# EAGLE design PR9003 (EAGLE 6.6.0)
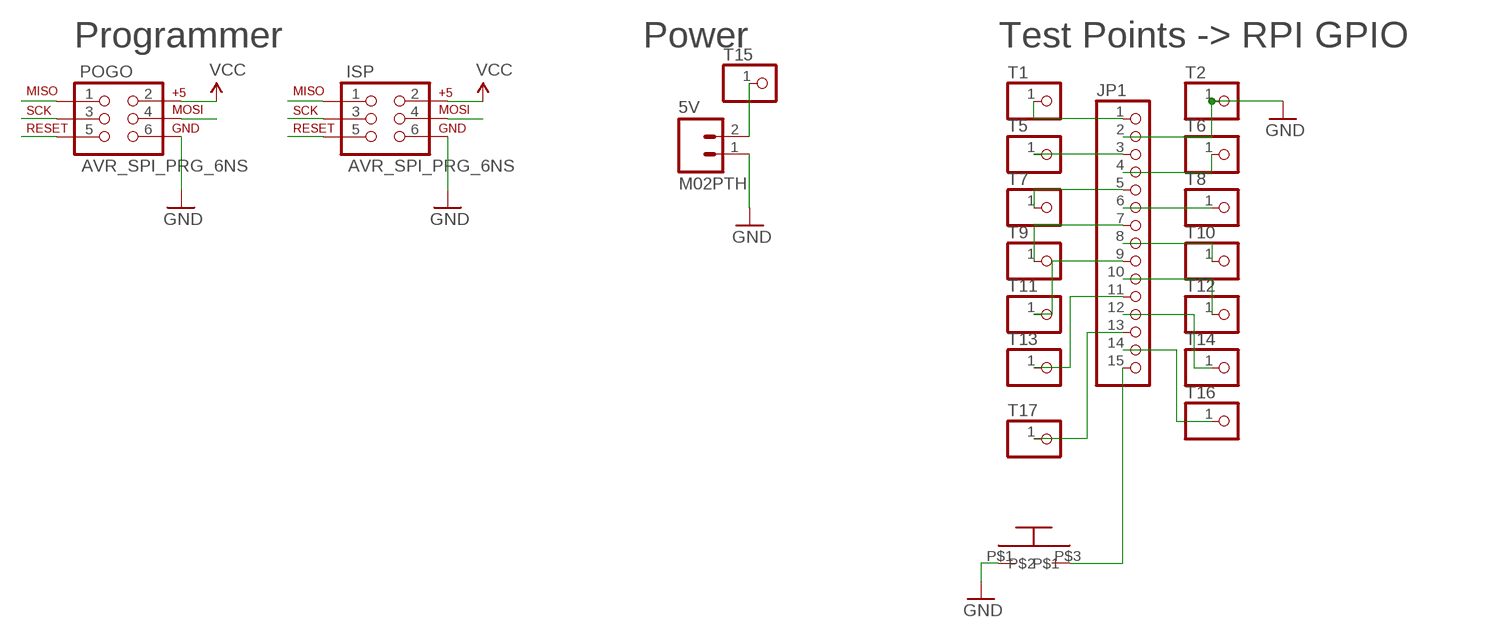
[diagram p0: schematic, sheet 1]

## Parts
5V  M02PTH  [1X02]
ISP  AVR_SPI_PRG_6NS  [2X3-NS]
JP1  PINHD-1X15  [1X15]
POGO  AVR_SPI_PRG_6NS  [2X3-NS]
T1  PINHD-1X1  [1X01]
T2  PINHD-1X1  [1X01]
T5  PINHD-1X1  [1X01]
T6  PINHD-1X1  [1X01]
T7  PINHD-1X1  [1X01]
T8  PINHD-1X1  [1X01]
T9  PINHD-1X1  [1X01]
T10  PINHD-1X1  [1X01]
T11  PINHD-1X1  [1X01]
T12  PINHD-1X1  [1X01]
T13  PINHD-1X1  [1X01]
T14  PINHD-1X1  [1X01]
T15  PINHD-1X1  [1X01]
T16  PINHD-1X1  [1X01]
T17  PINHD-1X1  [1X01]
U$1  C&K_D6C_SWITCH  [C&K_D6C_SWITCH]

## Nets
GND: 5V.1 ISP.6 JP1.2 POGO.6 T2.1 U$1.P$1
MISO: ISP.1 POGO.1
MOSI: ISP.4 POGO.4
N$1: JP1.1 T1.1
N$3: JP1.3 T5.1
N$4: JP1.4 T6.1
N$5: JP1.5 T7.1
N$6: JP1.6 T8.1
N$7: JP1.7 T9.1
N$8: JP1.8 T10.1
N$9: JP1.9 T11.1
N$10: JP1.10 T12.1
N$11: JP1.11 T13.1
N$12: JP1.12 T14.1
N$13: 5V.2 T15.1
N$14: JP1.14 T16.1
N$15: JP1.13 T17.1
N$16: JP1.15 U$1.P$3
RESET: ISP.5 POGO.5
SCK: ISP.3 POGO.3
VCC: ISP.2 POGO.2

## Notes on the sheet
- Programmer | Power | Test Points -> RPI GPIO

## Library data of the parts
5V = SparkFun-Connectors:M02: Standard 2-pin 0.1" header. Use with - straight break away headers ( PRT-00116) - right angle break away headers (PRT-00553) - swiss pins (PRT-00743) - machine pins (PRT-00117) - female headers (PRT-00115) Molex polarized connector foot print use with: PRT-08233 with associated crimp pins and housings. 2.54_SCREWTERM for use with PRT-10571. 3.5mm Screw Terminal footprints for PRT-08084 5mm Screw Terminal footprints for use with PRT-08432
ISP POGO = SparkFun-Connectors:AVR_SPI_PRG_6: AVR ISP 6 Pin This is the reduced ISP connector for AVR programming. Common on Arduino. This footprint will take up less PCB space and can be used with a 10-pin to 6-pin adapter such as SKU: BOB-08508 **Special note about "TEST_POINT" package. The stop mask is on the top side, so if you want your programming test points to be on the bottom of your board, make sure to place this package on the bottom side of the board. This also ensure that the orientation to program from the bottom side will be correct.
JP1 = adafruit:PINHD-1X15: PIN HEADER
T1 T2 T5-T17 = adafruit:PINHD-1X1: Pin header 1x1 for 0.1" spacing With round pins
U$1 = PR_Parts_Library:C&K_D6C_SWITCH

## Board
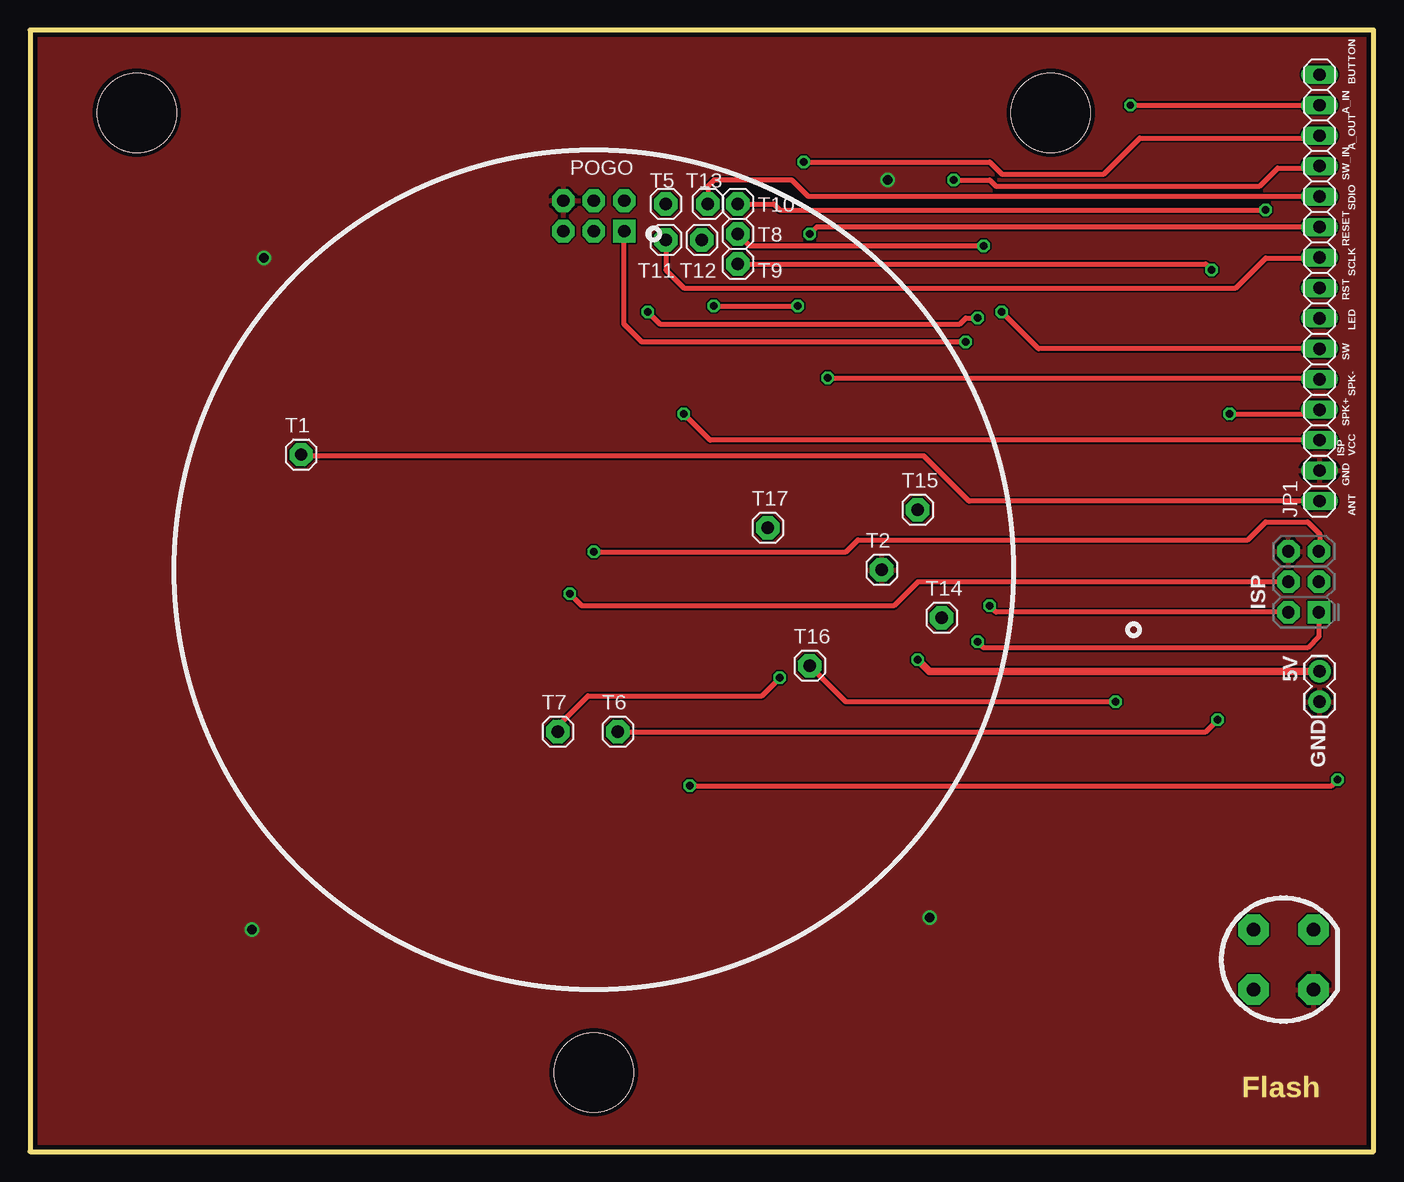
[diagram p1: board, top side]
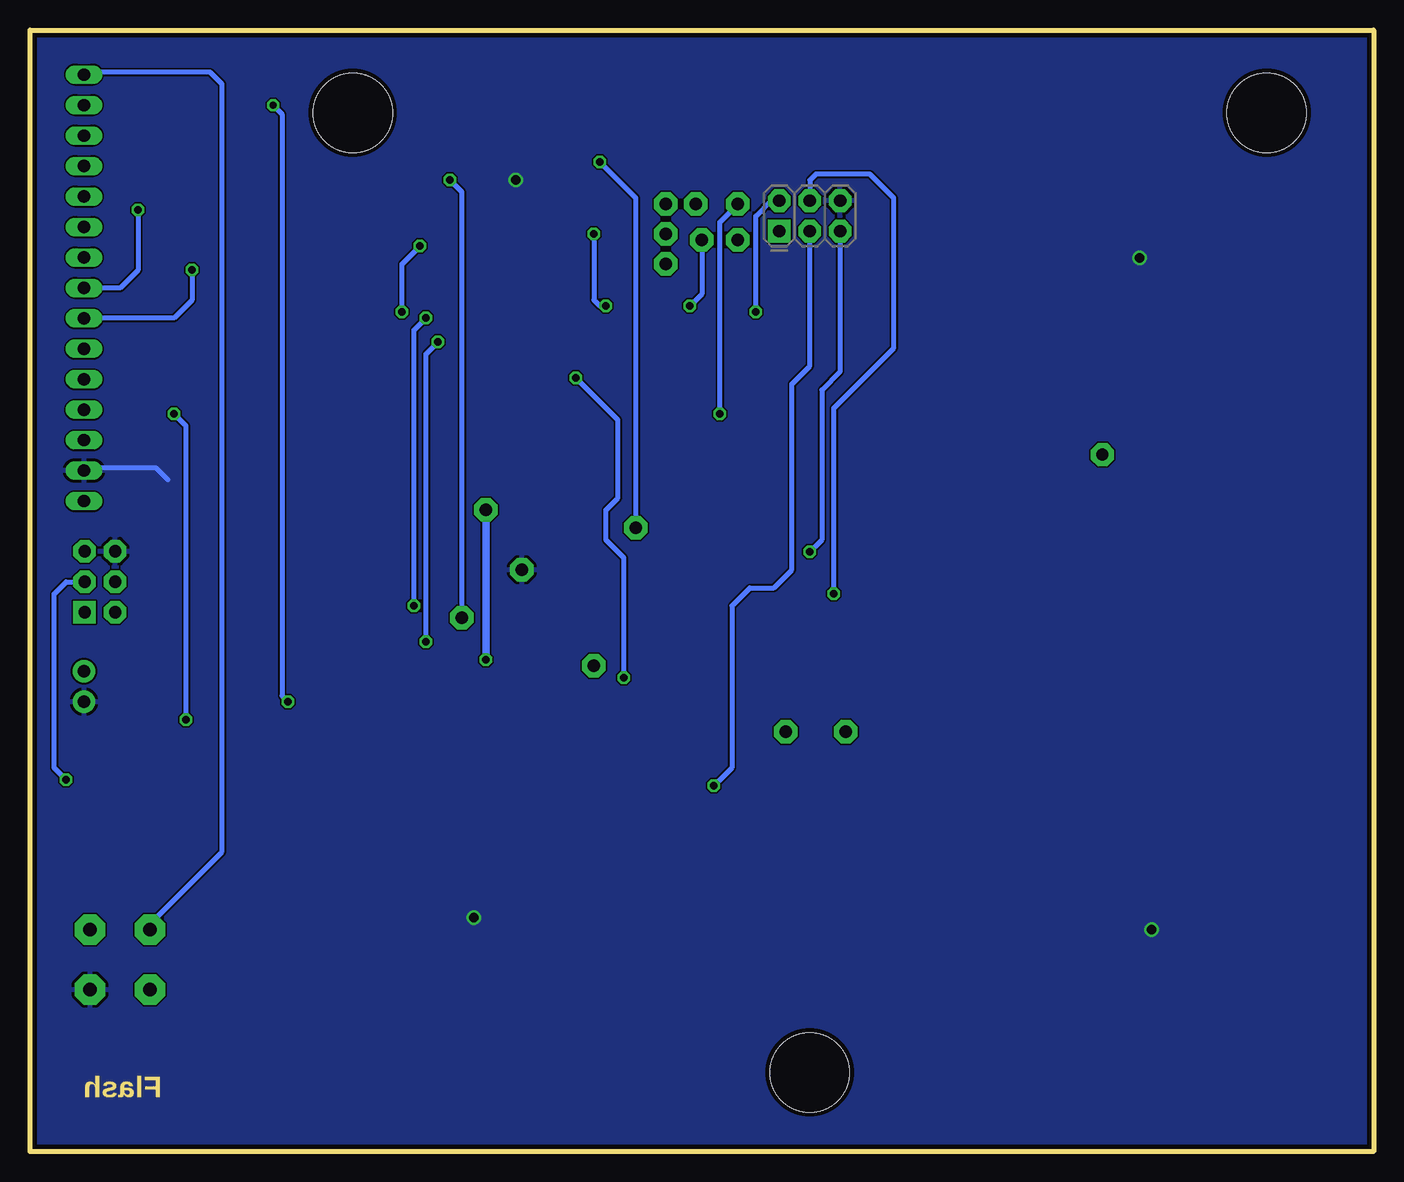
[diagram p2: board, bottom side, seen from below]

Size 112 x 93.5 mm. Coordinates in mm from the lower left corner, seen from the top.
Outline: 0,0 112,0 112,93.5 0,93.5 0,0
Copper layers (1*16): Top 0.035mm / dielectric 1.5mm / Bottom 0.035mm
Design rules "default *": minimum track width 6mil, minimum drill 13mil, track to track 6mil, track to pad 6mil, pad to pad 6mil, via to via 6mil, smd to smd 6mil, copper to edge 15mil, drill to drill 6mil, minimum pad ring 10mil, minimum via ring 8mil, stop-mask expansion 4mil, vias tented up to drill 30mil, thermal gap 10mil
Holes 6.6 mm at 8.9,86.6 85.1,86.6 47,6.6

### Footprints (pad centres in the part's own frame; a part is rotated, then mirrored left to right if it is on the bottom)
1X02 = drill 1.016 pad 1.88: 1 0,0; 2 2.54,0
2X3-NS = drill 1.016 pad 1.88 square: 1 -2.54,-1.27 | drill 1.016 pad 1.88 octagon: 2 -2.54,1.27; 3 0,-1.27; 4 0,1.27; 5 2.54,-1.27; 6 2.54,1.27
1X15 = drill 1.016 long: 1 -17.78,0; 2 -15.24,0; 3 -12.7,0; 4 -10.16,0; 5 -7.62,0; 6 -5.08,0; 7 -2.54,0; 8 0,0; 9 2.54,0; 10 5.08,0; 11 7.62,0; 12 10.16,0; 13 12.7,0; 14 15.24,0; 15 17.78,0
1X01 = drill 1.016 pad 1.93 octagon: 1 0,0
C&K_D6C_SWITCH = drill 1.1 pad 2.54 octagon: P$1 -2.5,2.5; P$2 2.5,2.5; P$3 2.5,-2.5; P$4 -2.5,-2.5

### Placement (x,y rotation side)
5V  107.5,37.5 90 top
ISP  106.17,47.5 90 top
JP1  107.5,72 90 top
POGO  47,78 0 bottom
T1  22.6,58.1 0 top
T2  71,48.5 0 top
T5  53,79 0 top
T6  49,35 0 top
T7  44,35 0 top
T8  59,76.5 0 top
T9  59,74 0 top
T10  59,79 0 top
T11  53,76 0 top
T12  56,76 0 top
T13  56.5,79 0 top
T14  76,44.5 0 top
T15  74,53.5 0 top
T16  65,40.5 0 top
T17  61.5,52 0 top
U$1  104.5,16 180 top

### Tracks (layer width: path | path; a pad name or v marks a point on that pad's centre or on a via)
GND  (via drill 0.8)
  Bottom 0.406: 100.5,56 101.5,57 107.26,57
  other vias: 19.5,74.5 18.5,18.5 75,19.5 71.5,81
  pour Top: -1,-0.5 112,-0.5 112,93.5 -1,93.5
  pour Bottom: -1,-0.5 112,-0.5 112,93.5 -1,93.5
MISO  (via drill 0.6)
  Top 0.406: ISP.1 107.44,42.94 106.5,42 79.5,42 v79,42.5 | v78,67.5 51,67.5 49.5,69 49.5,76.69 POGO.1
  Bottom 0.406: 49.5,76.69 POGO.1 | v79,42.5 79,66.5 v78,67.5
MOSI  (via drill 0.6)
  Top 0.406: ISP.4 74,47.5 72,45.5 46,45.5 v45,46.5
  Bottom 0.406: v45,46.5 45,62 40,67 40,79.5 42,81.5 46.5,81.5 47,81 POGO.4
N$1
  Top 0.406: JP1.1 78.28,54.22 74.5,58 22.7,58 T1.1
N$3  (via drill 0.6)
  Top 0.406: JP1.3 56.7,59.3 v54.5,61.5
  Bottom 0.406: v54.5,61.5 54.5,77.5 T5.1
N$4  (via drill 0.6)
  Top 0.406: T6.1 98,35 v99,36 | v100,61.5 107.16,61.5 JP1.4
  Bottom 0.406: v99,36 99,60.5 v100,61.5
N$5  (via drill 0.6)
  Top 0.406: T7.1 44,35.5 46.5,38 61,38 v62.5,39.5 | v66.5,64.5 107.38,64.5 JP1.5
  Bottom 0.406: v66.5,64.5 63,61 63,54.5 64,53.5 64,51 62.5,49.5 v62.5,39.5
N$6  (via drill 0.6)
  Top 0.406: JP1.6 84.08,66.92 v81,70 | v79.5,75.5 60,75.5 T8.1
  Bottom 0.406: v81,70 81,74 v79.5,75.5
N$7  (via drill 0.6)
  Top 0.406: T9.1 98,74 v98.5,73.5
  Bottom 0.406: v98.5,73.5 98.5,71 100,69.5 107.46,69.5 JP1.7
N$8  (via drill 0.6)
  Top 0.406: T10.1 62,79 62.5,78.5 v103,78.5
  Bottom 0.406: v103,78.5 103,73.5 104.5,72 JP1.8
N$9
  Top 0.406: T11.1 53,73.5 54.5,72 100.5,72 103,74.5 107.46,74.5 JP1.9
  Bottom 0.406: 107.46,74.5 JP1.9
N$10  (via drill 0.6)
  Top 0.406: JP1.10 65.58,77.08 v65,76.5 | v57,70.5 v64,70.5
  Bottom 0.406: v65,76.5 65,71 64.5,70.5 v64,70.5 | T12.1 56,71.5 v57,70.5
N$11
  Top 0.406: JP1.11 64.88,79.62 63.5,81 57,81 56.5,80.5 T13.1
N$12  (via drill 0.6)
  Top 0.406: v77,81 80,81 80.5,80.5 102.5,80.5 104,82 107.34,82 JP1.12
  Bottom 0.406: T14.1 76,80 v77,81
N$13  (via drill 0.6)
  Top 0.61: 5V.2 74.96,40.04 v74,41
  Bottom 0.61: v74,41 T15.1
N$14  (via drill 0.6)
  Top 0.406: v90.5,37.5 68,37.5 T16.1 | v91.74,87.24 JP1.14
  Bottom 0.406: v91.74,87.24 91,86.5 91,38 v90.5,37.5
N$15  (via drill 0.6)
  Top 0.406: v64.5,82.5 80,82.5 81,81.5 89.5,81.5 92.5,84.5 107.3,84.5 JP1.13
  Bottom 0.406: T17.1 61.5,79.5 v64.5,82.5
N$16
  Bottom 0.406: JP1.15 107.28,90 97,90 96,89 96,25 102,19 U$1.P$3
RESET  (via drill 0.6)
  Top 0.406: v47,50 68,50 69,51 101.5,51 103,52.5 106.5,52.5 107.5,51.5 107.5,50.1 ISP.5
  Bottom 0.406: POGO.5 44.46,65.04 46,63.5 46,51 v47,50
SCK  (via drill 0.6)
  Top 0.406: v55,30.5 108.5,30.5 v109,31
  Bottom 0.406: v55,30.5 53.5,32 53.5,45.5 52,47 50,47 48.5,48.5 48.5,64 47,65.5 POGO.3 | v109,31 110,32 110,46.5 109,47.5 ISP.3
VCC  (via drill 0.6)
  Top 0.406: ISP.2 80.54,44.96 v80,45.5 | v51.5,70 52,69.5 52.5,69 77.5,69 78,69.5 v79,69.5
  Bottom 0.406: POGO.2 50.23,79.27 51.5,78 v51.5,70 | v80,45.5 80,68.5 v79,69.5

### Text on the board
Dimension: Flash
tPlace: GND
tNames: BUTTON | A_IN | A_OUT | SW_IN | SDIO | RESET | SCLK | RST | LED | SW | SPK- | SPK+ | ISP / VCC | GND | ANT